# EAGLE design sd2iec (EAGLE 7.3.0)
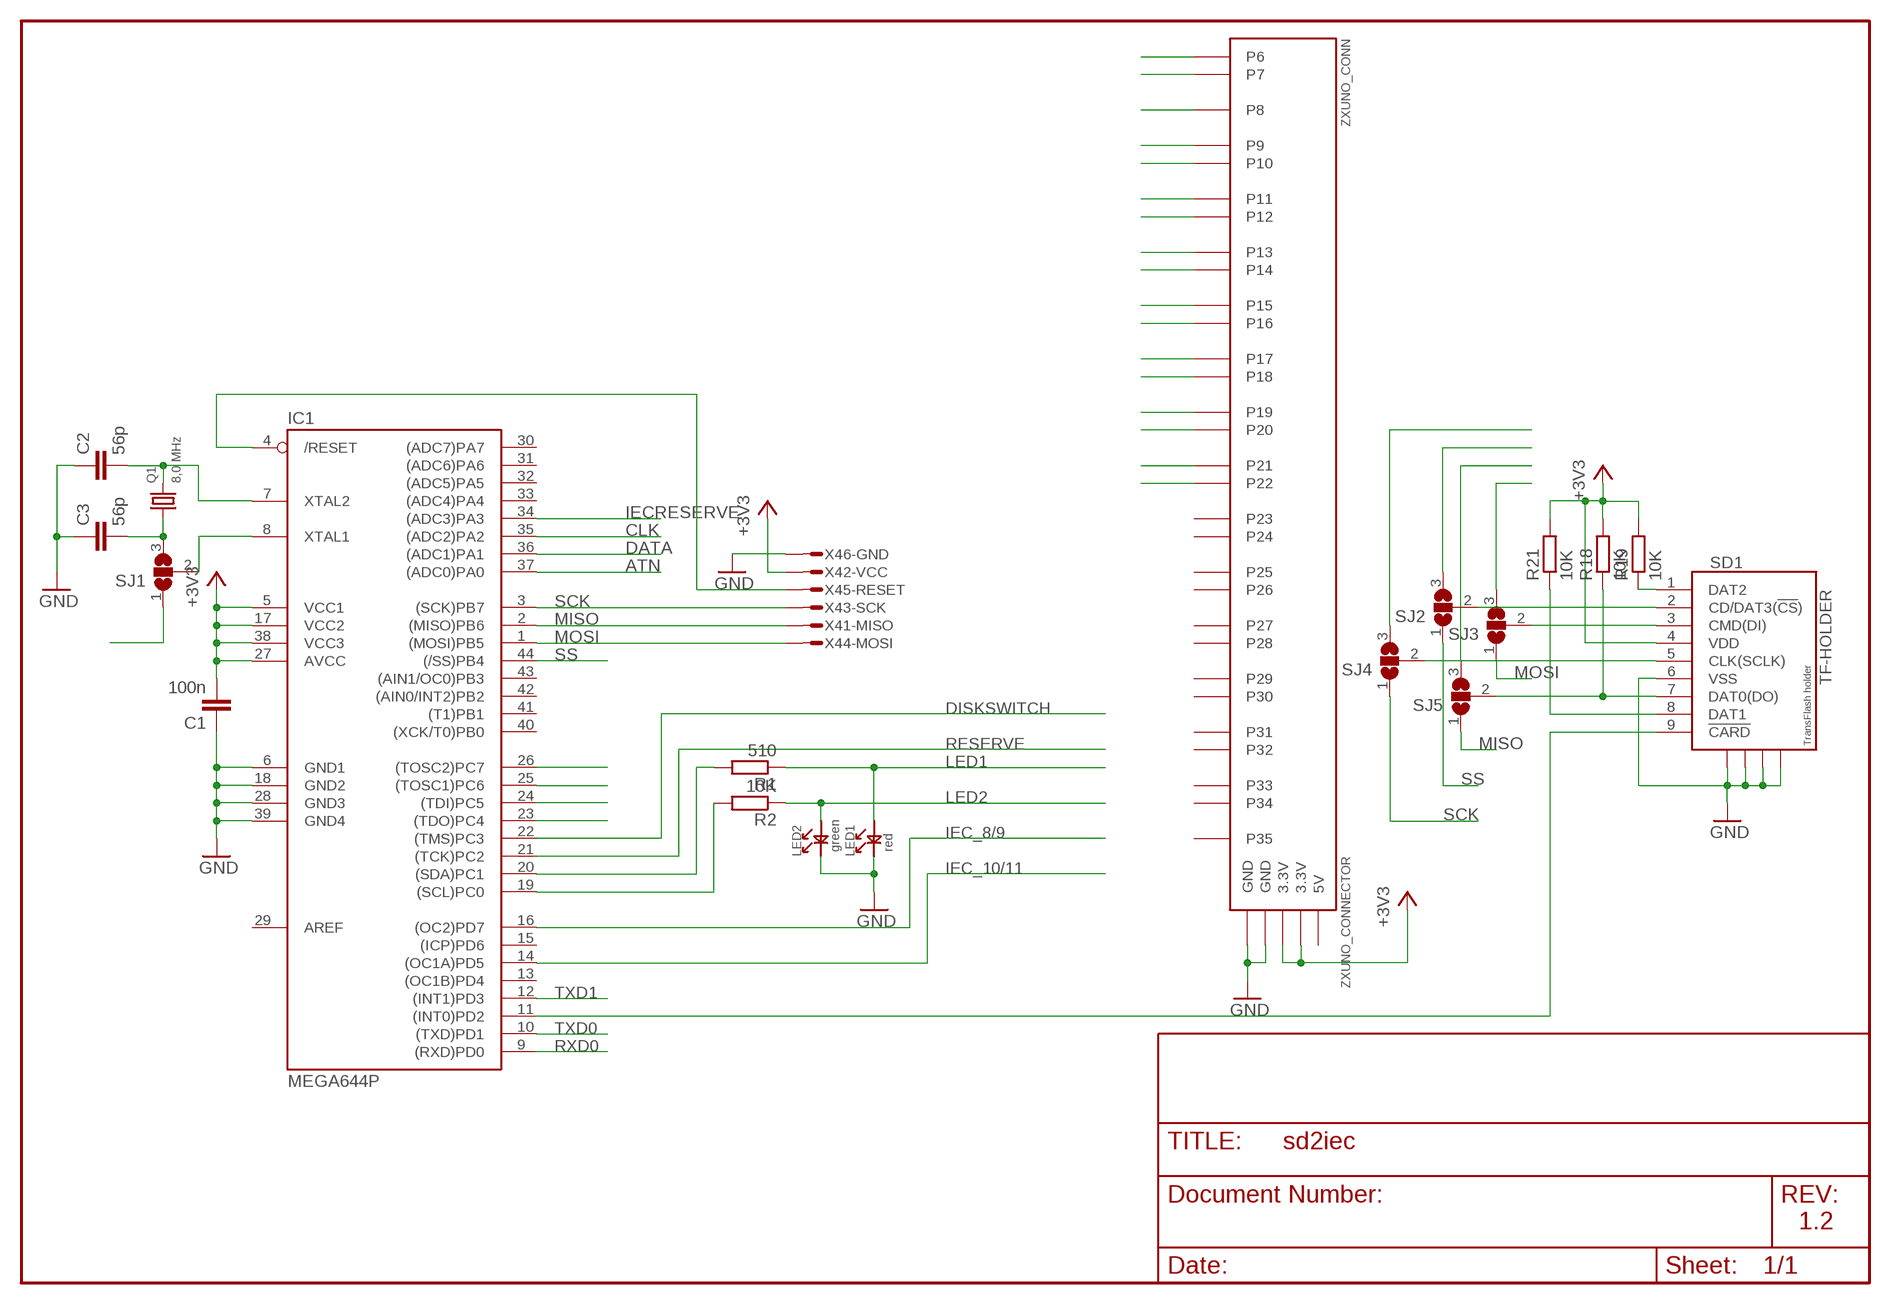
[diagram p0: schematic, sheet 1]

## Parts
C1  100n  C-EUC0805  [C0805]
C2  56p  C-EUC0805  [C0805]
C3  56p  C-EUC0805  [C0805]
IC1  MEGA644P  MEGA16/32TQFP  [TQFP44]
LED1  red  LED0805  [LED0805]
LED2  green  LED0805  [LED0805]
Q1  8,0 MHz  HC49  [HC49/S]
R1  510  R-EU_R0805  [R0805]
R2  10K  R-EU_R0805  [R0805]
R18  10K  R-EU_R0805  [R0805]
R19  10K  R-EU_R0805  [R0805]
R21  10K  R-EU_R0805  [R0805]
SD1  TF-HOLDER  [TF-PULL]
SJ1  SJ2W  [SJ_2]
SJ2  SJ2W  [SJ_2]
SJ3  SJ2W  [SJ_2]
SJ4  SJ2W  [SJ_2]
SJ5  SJ2W  [SJ_2]
X4  AVR-ISP_1X6  [1X6_ISP]
ZXUNO_CONN  ZXUNO_CONNECTOR  [ZXUNO_CONNECTOR]

## Nets
+3V3 [power]: C1.2 IC1.5(VCC1) IC1.17(VCC2) IC1.27(AVCC) IC1.38(VCC3) R18.2 R19.2 R21.2 SD1.4(VDD) X4.2 ZXUNO_CONN.3.3V@1(3.3V) ZXUNO_CONN.3.3V@2(3.3V)
/RESET: IC1.4(/RESET) X4.5
ATN: IC1.37((ADC0)PA0)
CD: IC1.11((INT0)PD2) SD1.9(!CARD)
CLK: IC1.35((ADC2)PA2)
DATA: IC1.36((ADC1)PA1)
DISKSWITCH: IC1.22((TMS)PC3)
GND: C1.1 C2.1 C3.1 IC1.6(GND1) IC1.18(GND2) IC1.28(GND3) IC1.39(GND4) LED1.1 LED2.1 SD1.6(VSS) SD1.S1 SD1.S2 SD1.S3 SD1.S4 X4.6 ZXUNO_CONN.GND@1(GND) ZXUNO_CONN.GND@2(GND)
IEC_8/9: IC1.16((OC2)PD7)
IEC_10/11: IC1.14((OC1A)PD5)
IECRESERVE: IC1.34((ADC3)PA3)
LED1: LED1.2 R1.1
LED2: LED2.2 R2.1
MISO: IC1.2((MISO)PB6) SJ5.1 X4.1
MOSI: IC1.1((MOSI)PB5) SJ3.1 X4.4
N$1: IC1.23((TDO)PC4)
N$2: R18.1 SD1.7(DAT0(DO)) SJ5.2
N$3: SD1.3(CMD(DI)) SJ3.2
N$4: C3.2 Q1.1 SJ1.3
N$5: C2.2 IC1.7(XTAL2) Q1.2
N$6: SD1.2(CD/DAT3(!CS!)) SJ2.2
N$7: IC1.24((TDI)PC5)
N$8: IC1.8(XTAL1) SJ1.2
N$9: R19.1 SD1.1(DAT2)
N$10: SD1.5(CLK(SCLK)) SJ4.2
N$11: IC1.25((TOSC1)PC6)
N$12: IC1.26((TOSC2)PC7)
N$13: R21.1 SD1.8(DAT1)
N$14: SJ4.3
N$15: SJ2.3
N$16: SJ3.3
N$17: SJ1.1
P6: ZXUNO_CONN.P6
P7: ZXUNO_CONN.P7
P8: ZXUNO_CONN.P8
P9: ZXUNO_CONN.P9
P10: ZXUNO_CONN.P10
P11: ZXUNO_CONN.P11
P12: ZXUNO_CONN.P12
P13: ZXUNO_CONN.P13
P14: ZXUNO_CONN.P14
P15: ZXUNO_CONN.P15
P16: ZXUNO_CONN.P16
P17: ZXUNO_CONN.P17
P18: ZXUNO_CONN.P18
P19: ZXUNO_CONN.P19
P20: ZXUNO_CONN.P20
P21: ZXUNO_CONN.P21
P22: ZXUNO_CONN.P22
PC0: IC1.19((SCL)PC0) R2.2
PC1: IC1.20((SDA)PC1) R1.2
RESERVE: IC1.21((TCK)PC2)
RXD0: IC1.9((RXD)PD0)
SCK: IC1.3((SCK)PB7) SJ4.1 X4.3
SS: IC1.44((/SS)PB4) SJ2.1
TXD0: IC1.10((TXD)PD1)
TXD1: IC1.12((INT1)PD3)
Unconnected: IC1.13((OC1B)PD4) IC1.15((ICP)PD6) IC1.29(AREF) IC1.30((ADC7)PA7) IC1.31((ADC6)PA6) IC1.32((ADC5)PA5) IC1.33((ADC4)PA4) IC1.40((XCK/T0)PB0) IC1.41((T1)PB1) IC1.42((AIN0/INT2)PB2) IC1.43((AIN1/OC0)PB3) SJ5.3 ZXUNO_CONN.P23 ZXUNO_CONN.P24 ZXUNO_CONN.P25 ZXUNO_CONN.P26 ZXUNO_CONN.P27 ZXUNO_CONN.P28 ZXUNO_CONN.P29 ZXUNO_CONN.P30 ZXUNO_CONN.P31 ZXUNO_CONN.P32 ZXUNO_CONN.P33 ZXUNO_CONN.P34 ZXUNO_CONN.P35

## Notes on the sheet
- 1.2

## Power pins joined to a net without a drawn wire
5V: ZXUNO_CONN.5V

## Library data of the parts
C1-C3 = rcl:C-EU: CAPACITOR, European symbol
IC1 = 0_rr:MEGA16/32: MICROCONTROLLER 16 Kbytes FLASH, 512 bytes EEPROM 1 Kbytes SRAM dual UART hardware multiplier
LED1 LED2 = 0_rr:LED
Q1 = 0_rr:HC49
R1 R2 R18 R19 R21 = rcl:R-EU_: RESISTOR, European symbol
SD1 = sd-mmc:TF-HOLDER: TF / Micro SD socket is PUSH-PUSH type, the card can be pushed into and auto locked and pushed out by simply press the card. Surface Mounting type.
SJ1-SJ5 = jumper:SJ2W: SMD solder JUMPER
X4 = 0_rr:AVR-ISP: MicroMaTch 6 7-215464-6 / 0-215464-6 Drawing Number C-215464 DDEController.pdf
ZXUNO_CONN = zxuno:ZXUNO_CONNECTOR

## Net classes
0 default: width 0.178 mm, clearance 0.178 mm
1 power: width 0.305 mm, clearance 0.178 mm to class 0, clearance 0.229 mm

## Board
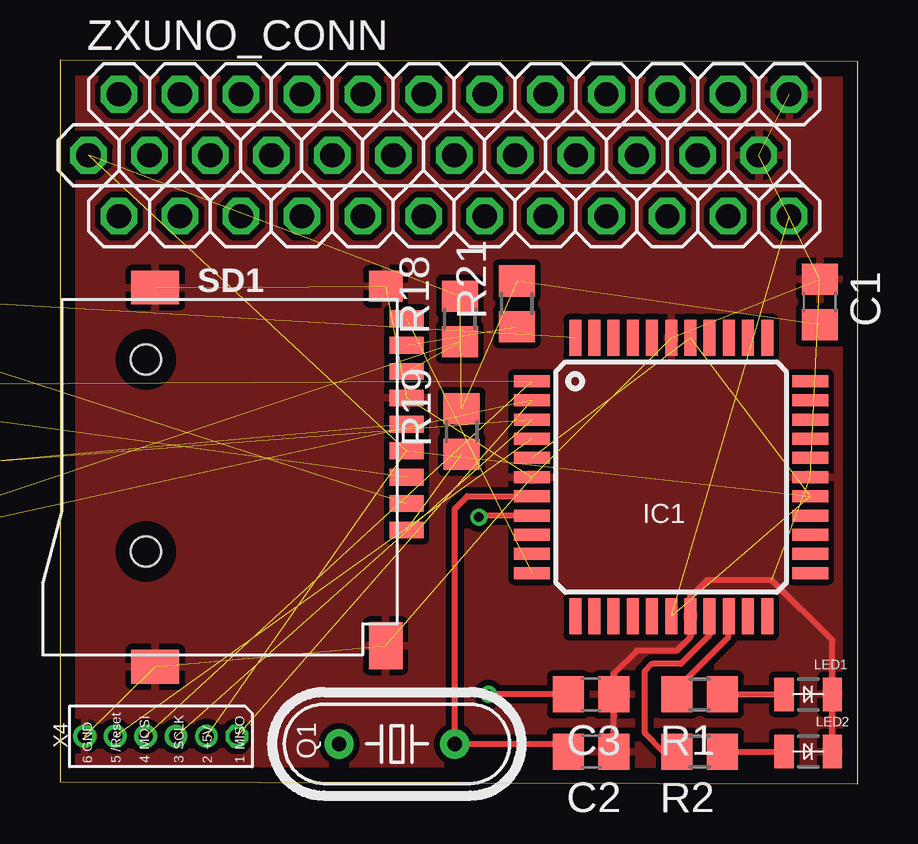
[diagram p1: board, top side]
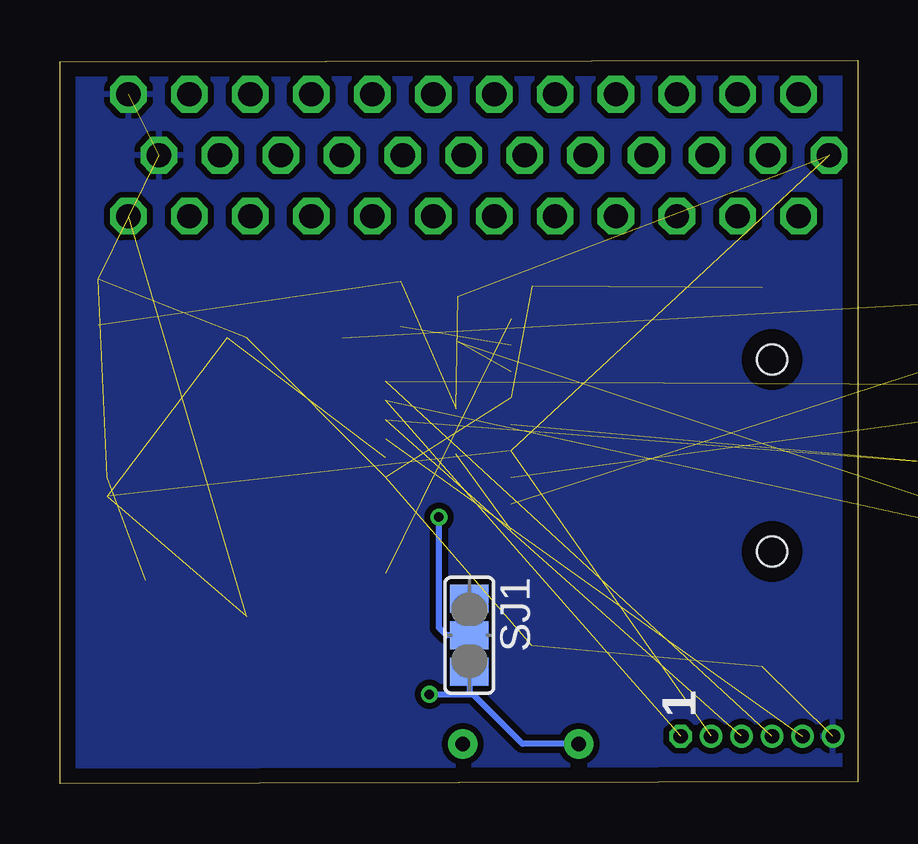
[diagram p2: board, bottom side, seen from below]

Size 33.26 x 30.16 mm. Coordinates in mm from the lower left corner, seen from the top.
Outline: 0,0.08 33.26,0 33.26,30.08 0,30.16 0,0.08
Copper layers (1*16): Top 0.035mm / dielectric 1.5mm / Bottom 0.035mm
Design rules "default": minimum track width 8mil, minimum drill 12mil, track to track 8mil, track to pad 8mil, pad to pad 8mil, via to via 8mil, smd to smd 8mil, copper to edge 25mil, drill to drill 8mil, minimum pad ring 6mil, minimum via ring 6mil, stop-mask expansion 4mil, vias tented up to drill 12mil, thermal gap 10mil
tRestrict: 1 lines

### Footprints (pad centres in the part's own frame; a part is rotated, then mirrored left to right if it is on the bottom)
C0805 = smd 1.3 x 1.5: 1 -0.95,0; 2 0.95,0
TQFP44 = smd 1.5 x 0.5: 1 -5.8,4; 2 -5.8,3.2; 3 -5.8,2.4; 4 -5.8,1.6; 5 -5.8,0.8; 6 -5.8,0; 7 -5.8,-0.8; 8 -5.8,-1.6; 9 -5.8,-2.4; 10 -5.8,-3.2; 11 -5.8,-4; 23 5.8,-4; 24 5.8,-3.2; 25 5.8,-2.4; 26 5.8,-1.6; 27 5.8,-0.8; 28 5.8,0; 29 5.8,0.8; 30 5.8,1.6; 31 5.8,2.4; 32 5.8,3.2; 33 5.8,4 | smd 0.5 x 1.5: 12 -4,-5.8; 13 -3.2,-5.8; 14 -2.4,-5.8; 15 -1.6,-5.8; 16 -0.8,-5.8; 17 0,-5.8; 18 0.8,-5.8; 19 1.6,-5.8; 20 2.4,-5.8; 21 3.2,-5.8; 22 4,-5.8; 34 4,5.8; 35 3.2,5.8; 36 2.4,5.8; 37 1.6,5.8; 38 0.8,5.8; 39 0,5.8; 40 -0.8,5.8; 41 -1.6,5.8; 42 -2.4,5.8; 43 -3.2,5.8; 44 -4,5.8
LED0805 = smd 0.8 x 1.4: 1 -1.009,0; 2 1.009,0
HC49/S = drill 0.6 pad 1.219: 1 -2.413,0; 2 2.413,0
R0805 = smd 1.3 x 1.5: 1 -0.95,0; 2 0.95,0
TF-PULL = smd 0.7 x 1.4: 1 -2.2,-7.62; 2 -1.1,-7.62; 3 0,-7.62; 4 1.1,-7.62; 5 2.2,-7.62; 6 3.3,-7.62; 7 4.4,-7.62; 8 5.5,-7.62; 9 6.6,-7.62 | smd 1.4 x 2: S1 -7.9,2.85; S2 7.9,2.85 | smd 1.28 x 1.4: S3 7.96,-6.75 | smd 1.95 x 1.4: S4 -7.025,-6.75 | hole 1.25: -3.1,3.25; 4.9,3.25
SJ_2 = smd 1.168 x 1.6: 1 -1.524,0; 2 0,0; 3 1.524,0
1X6_ISP = drill 0.6 pad 0.94 octagon: 1 0,0 | drill 0.6 pad 0.94: 2 1.27,0; 3 2.54,0; 4 3.81,0; 5 5.08,0; 6 6.35,0
ZXUNO_CONNECTOR = drill 1.016 octagon: 3.3V@1 -13.97,0; 3.3V@2 15.24,-2.54; 5V -12.7,-2.54; GND@1 15.24,2.54; GND@2 13.97,0; NC@1 12.7,2.54; P6 -12.7,2.54; P7 -10.16,-2.54; P8 -11.43,0; P9 -10.16,2.54; P10 -7.62,-2.54; P11 -8.89,0; P12 -7.62,2.54; P13 -5.08,-2.54; P14 -6.35,0; P15 -5.08,2.54; P16 -2.54,-2.54; P17 -3.81,0; P18 -2.54,2.54; P19 0,-2.54; P20 -1.27,0; P21 0,2.54; P22 2.54,-2.54; P23 1.27,0; P24 2.54,2.54; P25 5.08,-2.54; P26 3.81,0; P27 5.08,2.54; P28 7.62,-2.54; P29 6.35,0; P30 7.62,2.54; P31 10.16,-2.54; P32 8.89,0; P33 10.16,2.54; P34 12.7,-2.54; P35 11.43,0

### Placement (x,y rotation side)
C1  31.67,20.08 270 top
C2  22.15,1.35 180 top
C3  22.15,3.73 180 top
IC1  25.48,12.78 0 top
LED1  31.19,3.73 180 top
LED2  31.19,1.35 180 top
Q1  14.05,1.67 0 top
R1  26.67,3.73 180 top
R2  26.67,1.35 180 top
R18  16.67,19.37 90 top
R19  16.75,14.68 90 top
R21  19.05,20 90 top
SD1  6.83,12.78 90 top
SJ1  16.19,6.19 270 bottom
SJ2  -13.57,20.72 0 top  (outside the outline)
SJ3  -13.57,16.59 0 top  (outside the outline)
SJ4  -13.57,12.46 0 top  (outside the outline)
SJ5  -13.57,8.33 0 top  (outside the outline)
X4  7.38,1.98 180 top
ZXUNO_CONN  15.16,26.19 0 top

### Tracks (layer width: path | path; a pad name or v marks a point on that pad's centre or on a via)
+3V3  (11 unrouted)
/RESET  (1 unrouted)
CD  (1 unrouted)
GND  (12 unrouted)
  Top 0.254: LED2.1 LED1.1 32.2,5.98 29.69,8.49 26.99,8.49 26.27,7.78 26.28,7.77 IC1.18 26.28,6.12 25.72,5.56 24.05,5.56 23.1,4.6 C3.1 C2.1
  pour Top (isolate 0.254): 0,0.08 0,30.16 33.26,30.08 33.26,0
  pour Bottom (isolate 0.254): 0,0.08 0,30.16 33.26,30.08 33.26,0
LED1
  Top 0.254: R1.1 LED1.2
LED2
  Top 0.254: R2.1 LED2.2 | LED2.2
MISO  (2 unrouted)
MOSI  (2 unrouted)
N$2  (2 unrouted)
N$3  (1 unrouted)
N$4  (via drill 0.4)
  Top 0.254: C3.2 v17.86,3.73
  Bottom 0.254: Q1.1 13.97,1.67 16.03,3.73 16.19,3.73 | v17.86,3.73 16.19,3.73 | SJ1.3 16.19,3.73
N$5
  Top 0.254: C2.2 20.88,1.67 Q1.2 16.46,11.46 16.99,11.99 19.12,11.99 IC1.7
N$6  (1 unrouted)
N$8  (via drill 0.4)
  Top 0.254: 17.54,11.19 v17.46,11.11 17.53,11.18 IC1.8
  Bottom 0.254: SJ1.2 17.14,6.19 17.46,6.51 v17.46,11.11
N$9  (1 unrouted)
N$10  (1 unrouted)
N$13  (1 unrouted)
PC0
  Top 0.254: IC1.19 27.08,6.2 25.88,5 24.69,5 24.37,4.68 24.37,2.14 25.16,1.35 R2.2
PC1
  Top 0.254: R1.2 25.72,3.97 27.86,6.11 27.86,6.96 IC1.20
SCK  (2 unrouted)
SS  (1 unrouted)

### Text on the board
tPlace: 6 | GND | /Reset | 5 | 4 | MOSI | 3 | SCLK | +5V | 2 | 1 | MISO
bNames: 1